# Altium project PCB_Anchor.PrjPcb
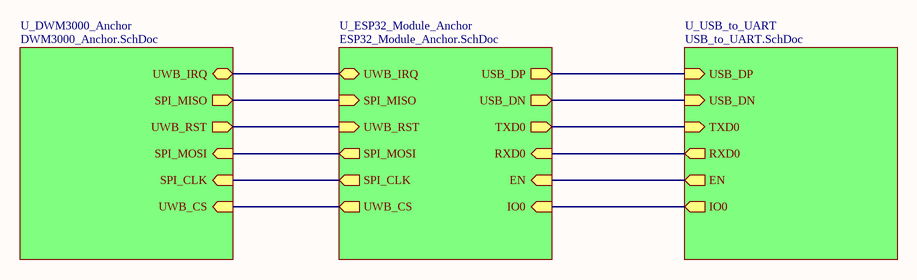
[diagram p0: Main.SchDoc]
4 sheets, 35 parts. Net scope: hierarchical (ports join the sheet entries above them; power ports are global).
Board file: PCB_Anchor.PcbDoc
Sheets:
  Main.SchDoc
    U_ESP32_Module_Anchor = ESP32_Module_Anchor.SchDoc
    U_DWM3000_Anchor = DWM3000_Anchor.SchDoc
    U_USB_to_UART = USB_to_UART.SchDoc

## Sheet Main.SchDoc
size A; SheetNumber: 1; SheetTotal: 4

### Sub-sheets
U_DWM3000_Anchor = DWM3000_Anchor.SchDoc: UWB_IRQ (bidir), SPI_MOSI (in), SPI_MISO (out), SPI_CLK (in), UWB_CS (in), UWB_RST (out)
U_ESP32_Module_Anchor = ESP32_Module_Anchor.SchDoc: UWB_IRQ (bidir), SPI_MOSI (out), SPI_MISO (in), SPI_CLK (out), UWB_CS (out), UWB_RST (in), USB_DP (out), USB_DN (out), TXD0 (out), RXD0 (in), EN (in), IO0 (in)
U_USB_to_UART = USB_to_UART.SchDoc: USB_DP (in), USB_DN (in), TXD0 (in), RXD0 (out), EN (out), IO0 (out)

### Nets
NetC3_2: sheet U_ESP32_Module_Anchor/EN, sheet U_USB_to_UART/EN
NetR5_1: sheet U_ESP32_Module_Anchor/USB_DP, sheet U_USB_to_UART/USB_DP
NetR6_1: sheet U_ESP32_Module_Anchor/USB_DN, sheet U_USB_to_UART/USB_DN
NetR10_2: sheet U_ESP32_Module_Anchor/TXD0, sheet U_USB_to_UART/TXD0
NetR11_2: sheet U_ESP32_Module_Anchor/RXD0, sheet U_USB_to_UART/RXD0
NetR14_1: sheet U_ESP32_Module_Anchor/IO0, sheet U_USB_to_UART/IO0
NetU1_6: sheet U_ESP32_Module_Anchor/UWB_IRQ, sheet U_DWM3000_Anchor/UWB_IRQ
NetU1_12: sheet U_ESP32_Module_Anchor/UWB_RST, sheet U_DWM3000_Anchor/UWB_RST
NetU1_29: sheet U_ESP32_Module_Anchor/UWB_CS, sheet U_DWM3000_Anchor/UWB_CS
NetU1_30: sheet U_ESP32_Module_Anchor/SPI_CLK, sheet U_DWM3000_Anchor/SPI_CLK
NetU1_31: sheet U_ESP32_Module_Anchor/SPI_MISO, sheet U_DWM3000_Anchor/SPI_MISO
NetU1_37: sheet U_ESP32_Module_Anchor/SPI_MOSI, sheet U_DWM3000_Anchor/SPI_MOSI

## Sheet ESP32_Module_Anchor.SchDoc
size A; SheetNumber: 2; SheetTotal: 4
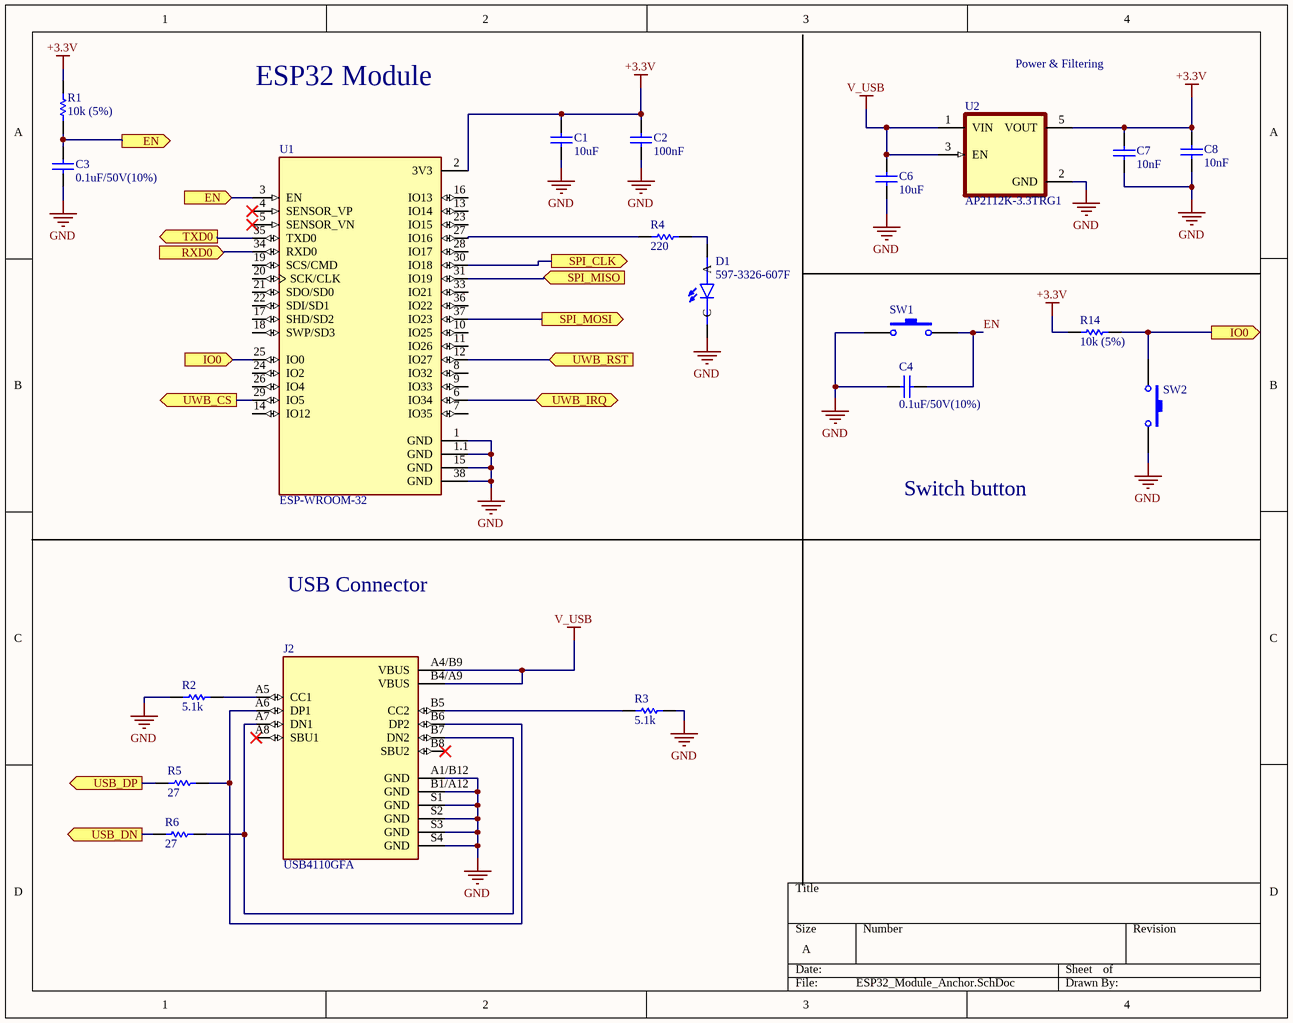
[diagram p1: ESP32_Module_Anchor.SchDoc]

### Parts
C1  value 10uF  [CAPC1608X90]  (hidden comment: Cap)
C2  value 100nF  [CAPC1005X55N]  (hidden comment: Cap)
C3  value 0.1uF/50V(10%)  [CAPC2012X94N]  (hidden comment: Cap)
C4  value 0.1uF/50V(10%)  [CAPC2012X94N]  (hidden comment: Cap)
C6  value 10uF  [CAPC1608X90]  (hidden comment: Cap)
C7  value 10nF  [CAPC1608X87N]  (hidden comment: Cap)
C8  value 10nF  [CAPC1608X87N]  (hidden comment: Cap)
D1  597-3326-607F  [LEDSC160X80X70L45N]
J2  USB4110GFA  [GCT_USB4110GFA]
R1  value 10k (5%)  [RESC1005X40]  (hidden comment: Res1)
R2  value 5.1k  [RESC1005X40]  (hidden comment: Res1)
R3  value 5.1k  [RESC1005X40]  (hidden comment: Res1)
R4  value 220  [RESC1005X40N]  (hidden comment: Res1)
R5  value 27  [RESC1608X60N]  (hidden comment: Res1)
R6  value 27  [RESC1608X60N]  (hidden comment: Res1)
R14  value 10k (5%)  [RESC1005X40]  (hidden comment: Res1)
SW1  SW-PB  [SW_TL3342F160QG]  (value not drawn)
SW2  SW-PB  [SW_TL3342F160QG]  (value not drawn)
U1  ESP-WROOM-32  [MODULE_ESP-WROOM-32]
U2  AP2112K-3.3TRG1  [SOT95P285X140-5N]

### Ports
EN (in), EN (out), IO0 (in), IO0 (out), RXD0 (in), SPI_CLK (out), SPI_MISO (in), SPI_MOSI (out), TXD0 (out), USB_DN (out), USB_DP (out), UWB_CS (out), UWB_IRQ (bidir), UWB_RST (in)

### Nets
+3.3V: C1.2 C2.2 C7.2 C8.2 R1.2 R14.2 U1.2(3V3) U2.5(VOUT)
GND: C1.1 C2.1 C3.1 C4.1 C6.1 C7.1 C8.1 D1.C J2.A1/B12(GND) J2.B1/A12(GND) J2.S1(GND) J2.S2(GND) J2.S3(GND) J2.S4(GND) R2.1 R3.2 SW1.1 SW2.2 U1.1(GND) U1.1.1(GND) U1.15(GND) U1.38(GND) U2.2(GND)
V_USB: C6.2 J2.A4/B9(VBUS) J2.B4/A9(VBUS) U2.1(VIN) U2.3(EN)
EN: C4.2 SW1.2
NetC3_2: C3.2 R1.1 U1.3(EN) ; port EN
NetD1_A: D1.A R4.2
NetJ2_A5: J2.A5(CC1) R2.2
NetJ2_A6: J2.A6(DP1) J2.B6(DP2) R5.2
NetJ2_A7: J2.A7(DN1) J2.B7(DN2) R6.2
NetJ2_B5: J2.B5(CC2) R3.1
NetR4_1: R4.1 U1.27(IO16)
NetR5_1: R5.1 ; port USB_DP
NetR6_1: R6.1 ; port USB_DN
NetR10_2: U1.35(TXD0) ; port TXD0
NetR11_2: U1.34(RXD0) ; port RXD0
NetR14_1: R14.1 SW2.1 U1.25(IO0) ; port IO0
NetU1_6: U1.6(IO34) ; port UWB_IRQ
NetU1_12: U1.12(IO27) ; port UWB_RST
NetU1_29: U1.29(IO5) ; port UWB_CS
NetU1_30: U1.30(IO18) ; port SPI_CLK
NetU1_31: U1.31(IO19) ; port SPI_MISO
NetU1_37: U1.37(IO23) ; port SPI_MOSI

Not connected (* = marked no-connect by the designer): J2 A8(SBU1)* B8(SBU2)*; U1 4(SENSOR_VP)* 5(SENSOR_VN)* 7(IO35) 8(IO32) 9(IO33) 10(IO25) 11(IO26) 13(IO14) 14(IO12) 16(IO13) 17(SHD/SD2) 18(SWP/SD3) 19(SCS/CMD) 20(SCK/CLK) 21(SDO/SD0) 22(SDI/SD1) 23(IO15) 24(IO2) 26(IO4) 28(IO17) 33(IO21) 36(IO22)

### Notes on the sheet
- ESP32 Module
- Power & Filtering
- Switch button
- USB Connector

### Library data of the parts
C1-C4 C6-C8 = Cap: Capacitor; Published: 8-Jun-2000; LatestRevisionDate: 17-Jul-2002; LatestRevisionNote: Re-released for DXP Platform.; PackageReference: RAD-0.3; Publisher: Altium Limited; PackageDescription: Radial Cap, Thru-Hole; 2 Leads; 0.3 in Pin Spacing
D1 = 597-3326-607F: SMD LED 0603 INGAN GREEN | Dialight 597-3326-607F; SnapEDA_Link: https://www.snapeda.com/parts/597-3326-607F/Dialight/view-part/?ref=snap; Package: 0603 Dialight; Value: *; MF: Dialight; MP: 597-3326-607F; Check_prices: https://www.snapeda.com/parts/597-3326-607F/Dialight/view-part/?ref=eda
J2 = USB4110GFA: USB-C (USB TYPE-C) USB 2.0 Receptacle Connector 24 (16+8 Dummy) Position Surface Mount, Right Angle; MF: Global Connector Technology; SnapEDA_Link: https://www.snapeda.com/parts/USB4110GFA/Global+Connector+Technology/view-part/?ref=snap; Package: None; Value: *; MP: USB4110GFA; Check_prices: https://www.snapeda.com/parts/USB4110GFA/Global+Connector+Technology/view-part/?ref=eda
R1-R6 R14 = Res1: Resistor; Published: 8-Jun-2000; LatestRevisionDate: 17-Jul-2002; LatestRevisionNote: Re-released for DXP Platform.; PackageReference: AXIAL-0.3; Publisher: Altium Limited; PackageDescription: Axial Device, Thru-Hole; 2 Leads; 0.3 in Pin Spacing
SW1 SW2 = SW-PB: Switch; Published: 24-Mar-1999; LatestRevisionDate: 17-Jul-2002; LatestRevisionNote: Re-released for DXP Platform.; PackageReference: SPST-2; Publisher: Altium Limited; PackageDescription: Switch; 2 Leads
U1 = ESP-WROOM-32: Transceptor serie ESP-WROOM-32; Placa de evaluaciÃ³n 802.11 b/g/n (Wi-Fi, WiFi, WLAN), BluetoothÂ® Smart 4.x de bajo consumo (BLE); MF: Espressif Systems; SnapEDA_Link: https://www.snapeda.com/parts/ESP-WROOM-32/Espressif+Systems/view-part/?ref=snap; Package: Module Espressif Systems; Value: *; MP: ESP-WROOM-32; Check_prices: https://www.snapeda.com/parts/ESP-WROOM-32/Espressif+Systems/view-part/?ref=eda
U2 = AP2112K-3.3TRG1: Linear Voltage Regulator IC Positive Fixed 1 Output 600mA SOT-25; MF: Diodes Inc.; Value: *; Purchase-URL: https://pricing.snapeda.com/search/part/AP2112K-3.3TRG1/?ref=eda; Package: SOT-753 Diodes Inc.; Availability: In Stock; Check_prices: https://www.snapeda.com/parts/AP2112K-3.3TRG1/Diodes+Inc./view-part/?ref=eda; Price: None; SnapEDA_Link: https://www.snapeda.com/parts/AP2112K-3.3TRG1/Diodes+Inc./view-part/?ref=snap; MP: AP2112K-3.3TRG1

## Sheet DWM3000_Anchor.SchDoc
size A; SheetNumber: 4; SheetTotal: 4
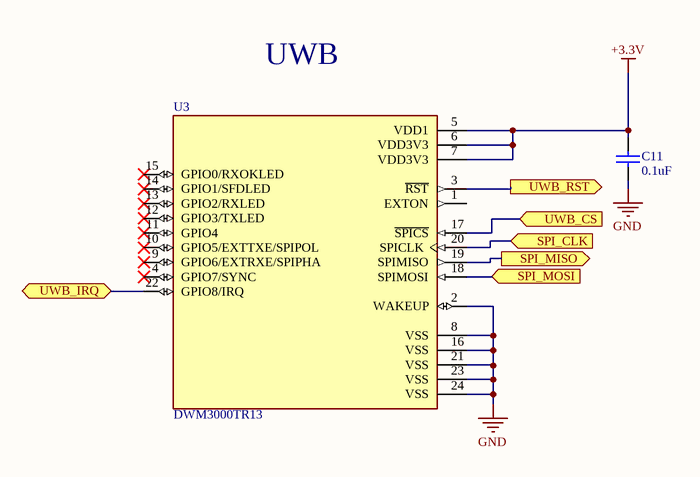
[diagram p2: DWM3000_Anchor.SchDoc]

### Parts
C11  value 0.1uF  [CAPC1005X55N]  (hidden comment: Cap)
U3  DWM3000TR13  [XCVR_DWM3000TR13]

### Ports
SPI_CLK (in), SPI_MISO (out), SPI_MOSI (in), UWB_CS (in), UWB_IRQ (bidir), UWB_RST (out)

### Nets
+3.3V: C11.2 U3.5(VDD1) U3.6(VDD3V3) U3.7(VDD3V3)
GND: C11.1 U3.2(WAKEUP) U3.8(VSS) U3.16(VSS) U3.21(VSS) U3.23(VSS) U3.24(VSS)
NetU1_6: U3.22(GPIO8/IRQ) ; port UWB_IRQ
NetU1_12: U3.3(~{RST}) ; port UWB_RST
NetU1_29: U3.17(~{SPICS}) ; port UWB_CS
NetU1_30: U3.20(SPICLK) ; port SPI_CLK
NetU1_31: U3.19(SPIMISO) ; port SPI_MISO
NetU1_37: U3.18(SPIMOSI) ; port SPI_MOSI

Not connected (* = marked no-connect by the designer): U3 1(EXTON) 4(GPIO7/SYNC)* 9(GPIO6/EXTRXE/SPIPHA)* 10(GPIO5/EXTTXE/SPIPOL)* 11(GPIO4)* 12(GPIO3/TXLED)* 13(GPIO2/RXLED)* 14(GPIO1/SFDLED)* 15(GPIO0/RXOKLED)*

### Notes on the sheet
- (near U3) UWB

### Library data of the parts
C11 = Cap: Capacitor; Published: 8-Jun-2000; LatestRevisionDate: 17-Jul-2002; LatestRevisionNote: Re-released for DXP Platform.; PackageReference: RAD-0.3; Publisher: Altium Limited; PackageDescription: Radial Cap, Thru-Hole; 2 Leads; 0.3 in Pin Spacing
U3 = DWM3000TR13: 802.15.4, Bluetooth, Cellular UWB, ZigbeeÂ® Transceiver Module 6.25GHz ~ 8.25GHz Integrated, Ceramic Patch Surface Mount; MF: Qorvo; SnapEDA_Link: https://www.snapeda.com/parts/DWM3000TR13/Qorvo/view-part/?ref=snap; Package: None; Value: *; MP: DWM3000TR13; Check_prices: https://www.snapeda.com/parts/DWM3000TR13/Qorvo/view-part/?ref=eda

## Sheet USB_to_UART.SchDoc
size A; SheetNumber: 3; SheetTotal: 4
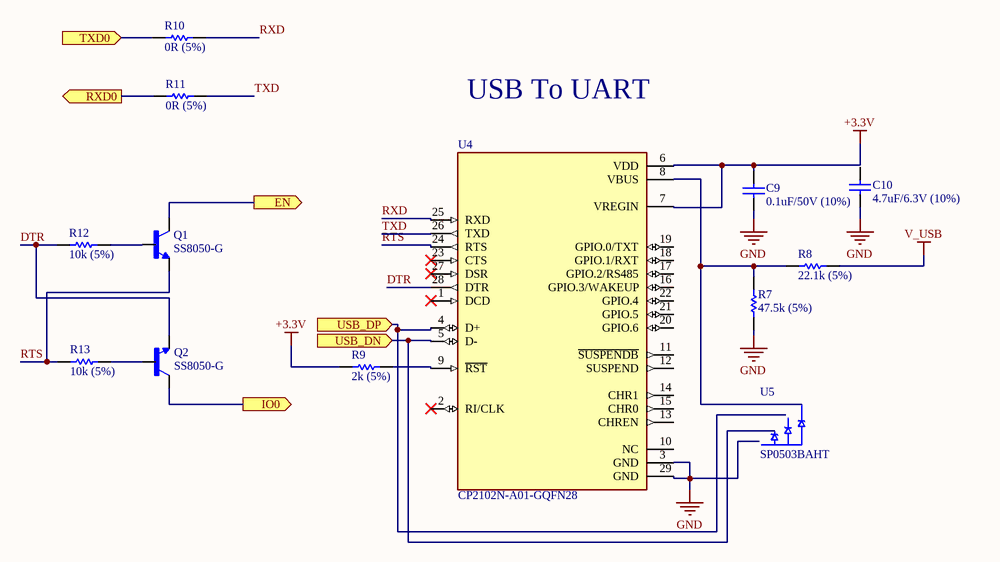
[diagram p3: USB_to_UART.SchDoc]

### Parts
C9  value 0.1uF/50V (10%)  [CAPC1608X90]  (hidden comment: Cap)
C10  value 4.7uF/6.3V (10%)  [CAPC1005X65N]  (hidden comment: Cap)
Q1  SS8050-G  [TRANS_SS8050-G]
Q2  SS8050-G  [TRANS_SS8050-G]
R7  value 47.5k (5%)  [RESC1607X60N]  (hidden comment: Res1)
R8  value 22.1k (5%)  [RESC1608X60N]  (hidden comment: Res1)
R9  value 2k (5%)  [RESC1608X55N]  (hidden comment: Res1)
R10  value 0R (5%)  [RESC1607X60N]  (hidden comment: Res1)
R11  value 0R (5%)  [RESC1607X60N]  (hidden comment: Res1)
R12  value 10k (5%)  [RESC1607X60N]  (hidden comment: Res1)
R13  value 10k (5%)  [RESC1607X60N]  (hidden comment: Res1)
U4  CP2102N-A01-GQFN28  [QFN50P500X500X80-29N]
U5  SP0503BAHT  [SOT143]

### Ports
EN (out), IO0 (out), RXD0 (out), TXD0 (in), USB_DN (in), USB_DP (in)

### Nets
+3.3V: C9.2 R9.2 U4.6(VDD) U4.7(VREGIN)
GND: C9.1 C10.1 R7.1 U4.3(GND) U4.29(GND)
V_USB: R8.1
DTR: Q2.2(E) R12.2 U4.28(DTR)
RTS: Q1.2(E) R13.2 U4.24(RTS)
RXD: R10.1 U4.25(RXD)
TXD: R11.1 U4.26(TXD)
NetC3_2: Q1.3(C) ; port EN
NetQ1_1: Q1.1(B) R12.1
NetQ2_1: Q2.1(B) R13.1
NetR5_1: U4.4(D+) ; port USB_DP
NetR6_1: U4.5(D-) ; port USB_DN
NetR7_2: R7.2 R8.2 U4.8(VBUS) U5.4(C)
NetR9_1: R9.1 U4.9(~{RST})
NetR10_2: R10.2 ; port TXD0
NetR11_2: R11.2 ; port RXD0

Not connected (* = marked no-connect by the designer): C10 2; Q2 3(C); U4 1(DCD)* 2(RI/CLK)* 10(NC) 11(~{SUSPENDB}) 12(SUSPEND) 13(CHREN) 14(CHR1) 15(CHR0) 16(GPIO.3/WAKEUP) 17(GPIO.2/RS485) 18(GPIO.1/RXT) 19(GPIO.0/TXT) 20(GPIO.6) 21(GPIO.5) 22(GPIO.4) 23(CTS)* 27(DSR)*; U5 1(GND) 2(A) 3(B)

### Notes on the sheet
- USB To UART

### Library data of the parts
C9 C10 = Cap: Capacitor; Published: 8-Jun-2000; LatestRevisionDate: 17-Jul-2002; LatestRevisionNote: Re-released for DXP Platform.; PackageReference: RAD-0.3; Publisher: Altium Limited; PackageDescription: Radial Cap, Thru-Hole; 2 Leads; 0.3 in Pin Spacing
Q1 Q2 = SS8050-G: Bipolar (BJT) Transistor NPN 25 V 1.5 A 100MHz 300 mW Surface Mount SOT-23-3; MP: SS8050G; MF: Comchip; Digi-Key_Part_Number: 641-1790-2-ND; Check_prices: https://www.snapeda.com/parts/SS8050G/Comchip/view-part/?ref=eda; Package: None; SnapEDA_Link: https://www.snapeda.com/parts/SS8050G/Comchip/view-part/?ref=snap; Value: *
R7-R13 = Res1: Resistor; Published: 8-Jun-2000; LatestRevisionDate: 17-Jul-2002; LatestRevisionNote: Re-released for DXP Platform.; PackageReference: AXIAL-0.3; Publisher: Altium Limited; PackageDescription: Axial Device, Thru-Hole; 2 Leads; 0.3 in Pin Spacing
U4 = CP2102N-A01-GQFN28: USB Bridge, USB to UART USB 2.0 UART Interface 28-QFN (5x5); MF: Silicon Labs; Price: None; Package: QFN-28 Silicon Labs; Purchase-URL: https://pricing.snapeda.com/search/part/CP2102N-A01-GQFN28/?ref=eda; Availability: In Stock; SnapEDA_Link: https://www.snapeda.com/parts/CP2102N-A01-GQFN28/Silicon+Labs/view-part/?ref=snap; Value: *; MP: CP2102N-A01-GQFN28; Check_prices: https://www.snapeda.com/parts/CP2102N-A01-GQFN28/Silicon+Labs/view-part/?ref=eda
U5 = SP0503BAHT: ESD Suppressors / TVS Diodes TVS AVAL DIODE SMT; MF: Littelfuse; SnapEDA_Link: https://www.snapeda.com/parts/SP0503BAHT/Ersa/view-part/?ref=snap; Package: SOT-143 Littelfuse; Value: *; MP: SP0503BAHT; Check_prices: https://www.snapeda.com/parts/SP0503BAHT/Ersa/view-part/?ref=eda

## Nets that join several sheets
+3.3V: ESP32_Module_Anchor (8 pins), DWM3000_Anchor (C11.2 U3.5 U3.6 U3.7), USB_to_UART (C9.2 R9.2 U4.6 U4.7)
GND: ESP32_Module_Anchor (23 pins), DWM3000_Anchor (7 pins), USB_to_UART (5 pins)
V_USB: ESP32_Module_Anchor (5 pins), USB_to_UART (R8.1)
NetC3_2: ESP32_Module_Anchor (C3.2 R1.1 U1.3), USB_to_UART (Q1.3)
NetR5_1: ESP32_Module_Anchor (R5.1), USB_to_UART (U4.4)
NetR6_1: ESP32_Module_Anchor (R6.1), USB_to_UART (U4.5)
NetR10_2: ESP32_Module_Anchor (U1.35), USB_to_UART (R10.2)
NetR11_2: ESP32_Module_Anchor (U1.34), USB_to_UART (R11.2)
NetU1_6: ESP32_Module_Anchor (U1.6), DWM3000_Anchor (U3.22)
NetU1_12: ESP32_Module_Anchor (U1.12), DWM3000_Anchor (U3.3)
NetU1_29: ESP32_Module_Anchor (U1.29), DWM3000_Anchor (U3.17)
NetU1_30: ESP32_Module_Anchor (U1.30), DWM3000_Anchor (U3.20)
NetU1_31: ESP32_Module_Anchor (U1.31), DWM3000_Anchor (U3.19)
NetU1_37: ESP32_Module_Anchor (U1.37), DWM3000_Anchor (U3.18)